# Altium schematic sheet Pack_BMS_Module.SchDoc: =SheetTitle
size A4; SheetTitle: Pack BMS Module; DrawnBy: Samyar Sadat Akhavi; SheetNumber: 1; SheetTotal: 5
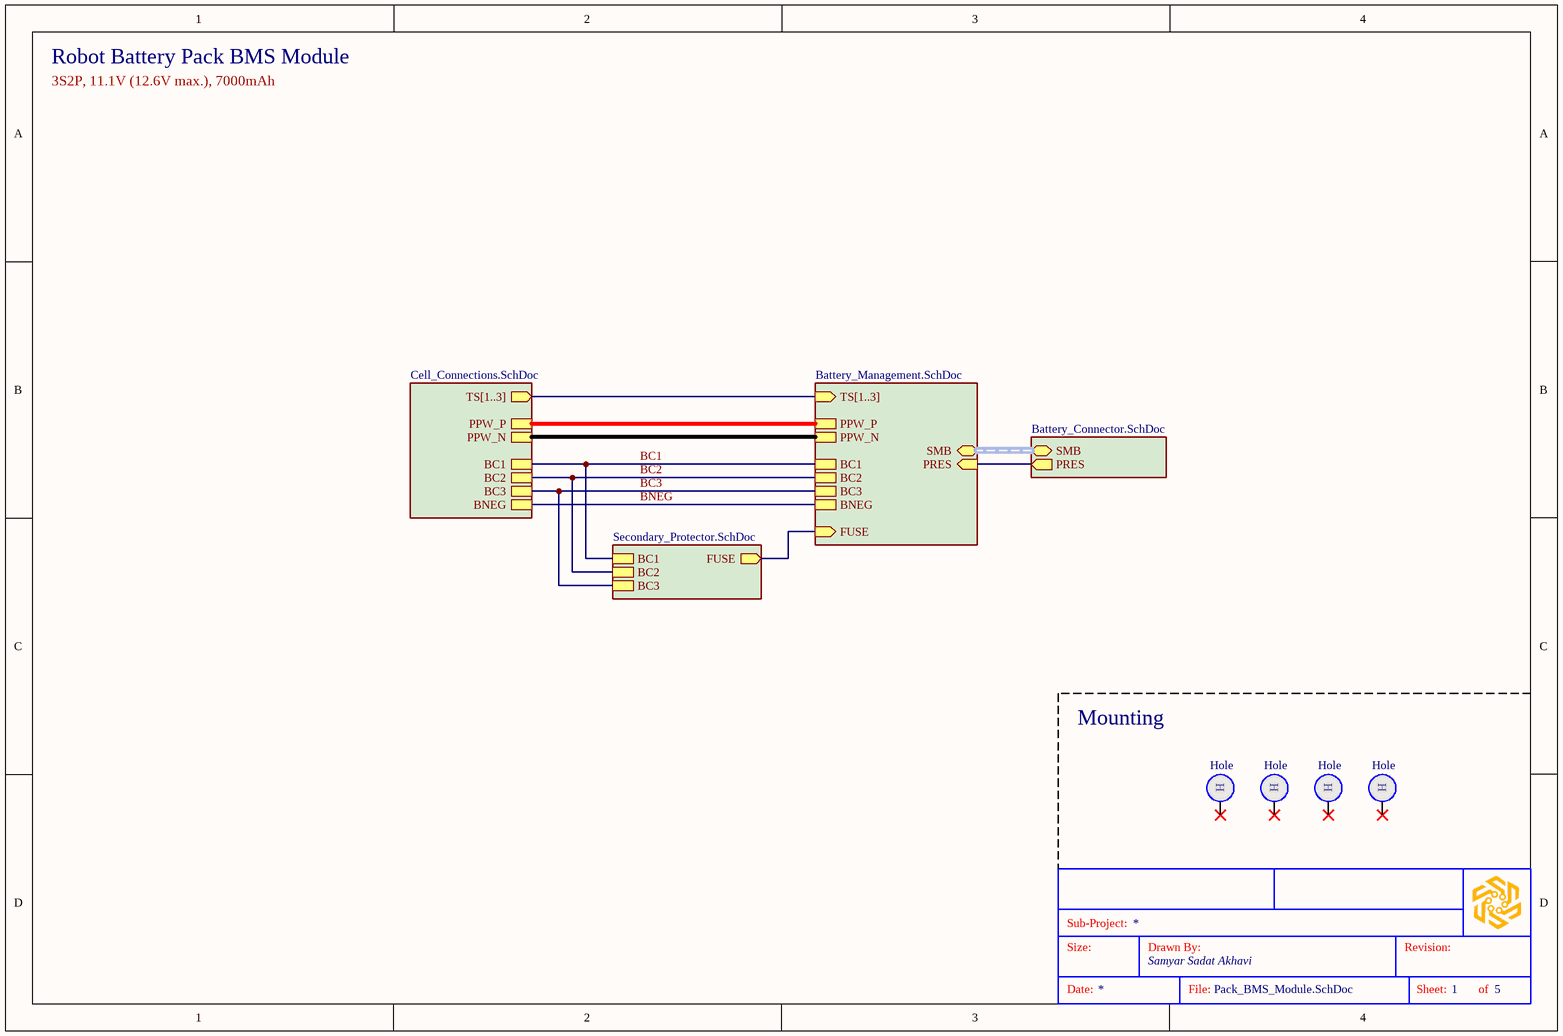
[diagram p0: Pack_BMS_Module.SchDoc]

## Parts
?  (no value)  (graphical)
MHL1  Hole  [Hole_2.6mm]  (no BOM)
MHL2  Hole  [Hole_2.6mm]  (no BOM)
MHL3  Hole  [Hole_2.6mm]  (no BOM)
MHL4  Hole  [Hole_2.6mm]  (no BOM)

## Sub-sheets
BATT_CONN = Battery_Connector.SchDoc: PRES (out), SMB (bidir, harness SMBus)
BATT_MGMT = Battery_Management.SchDoc: BC2, BC1, BNEG, BC3, FUSE (in), TS[1..3] (in), PPW_N, PPW_P, PRES (in), SMB (bidir, harness SMBus)
CELL_CONN = Cell_Connections.SchDoc: BC1, BC2, BC3, BNEG, TS[1..3] (out), PPW_N, PPW_P
SEC_PROT = Secondary_Protector.SchDoc: BC2, BC1, BC3, FUSE (out)

## Nets
BC1: sheet CELL_CONN/BC1, sheet BATT_MGMT/BC1, sheet SEC_PROT/BC1
BC2: sheet CELL_CONN/BC2, sheet BATT_MGMT/BC2, sheet SEC_PROT/BC2
BC3: sheet CELL_CONN/BC3, sheet BATT_MGMT/BC3, sheet SEC_PROT/BC3
BNEG: sheet CELL_CONN/BNEG, sheet BATT_MGMT/BNEG
(unnamed): sheet CELL_CONN/PPW_N, sheet BATT_MGMT/PPW_N
(unnamed): sheet CELL_CONN/PPW_P, sheet BATT_MGMT/PPW_P
(unnamed): sheet BATT_MGMT/FUSE, sheet SEC_PROT/FUSE
(unnamed): sheet BATT_MGMT/PRES, sheet BATT_CONN/PRES

Not connected (* = marked no-connect by the designer): MHL1 1*; MHL2 1*; MHL3 1*; MHL4 1*

## Buses and harness runs
bus sheet BATT_MGMT/TS[1..3] = sheet CELL_CONN/TS[1..3]
harness sheet BATT_CONN/SMB = sheet BATT_MGMT/SMB

## Notes on the sheet
- Robot Battery Pack BMS Module
- 3S2P, 11.1V (12.6V max.), 7000mAh
- Mounting
- Sub-Project:
- Size:
- Drawn By:
- Revision:
- Date:
- File:
- Sheet:
- of
- (in symbol GEN-PCBMHL2S6) H

## Library data of the parts
? = SGR-STDTBSA4: STANDARD SCHEMATICS TITLE BLOCK
MHL1-MHL4 = GEN-PCBMHL2S6: CIRCULAR PCB MOUNTING HOLE; Part Number: GEN-PCBMHL2S6; Size Variant: 2.6mm